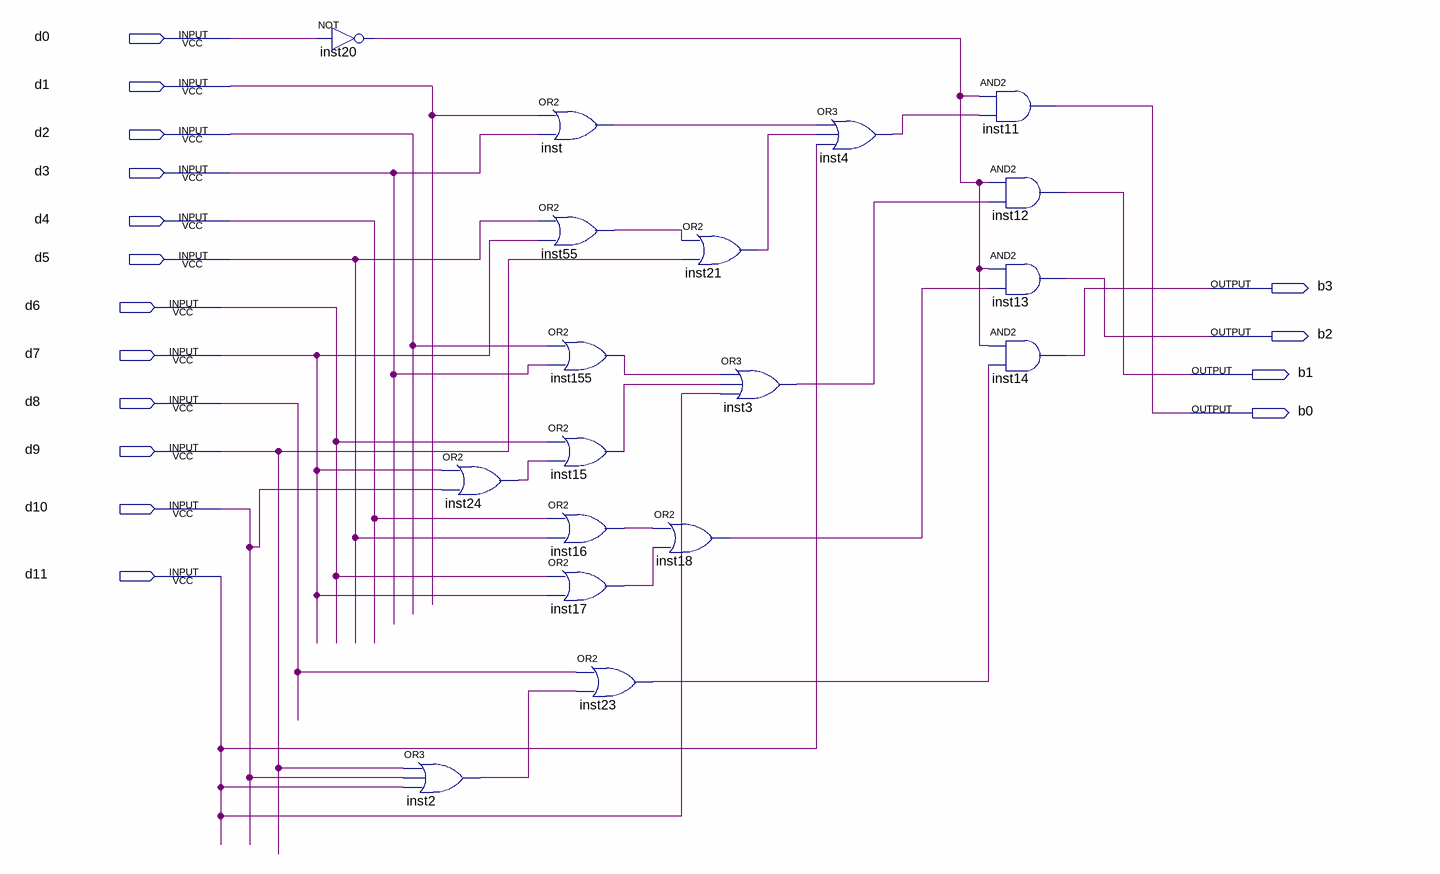
[diagram p0: schematic sheet]
// Quartus schematic d2b.bdf as structural Verilog: 18 symbols, 16 pins
module d2b (
  input  d0,
  input  d1,
  input  d2,
  input  d3,
  input  d4,
  input  d5,
  input  d6,
  input  d7,
  input  d8,
  input  d9,
  input  d10,
  input  d11,
  output b3,
  output b2,
  output b1,
  output b0
);

  wire inst2_out, inst3_out, inst4_out, inst15_out, inst16_out, inst17_out, inst18_out, inst20_out,
       inst21_out, inst23_out, inst24_out, inst55_out, inst155_out, inst_out;

  not inst20 (inst20_out, d0);
  or inst24 (inst24_out, d7, d10);
  or inst2 (inst2_out, d9, d10, d11);
  or inst (inst_out, d1, d3);
  or inst55 (inst55_out, d5, d7);
  or inst155 (inst155_out, d2, d3);
  or inst15 (inst15_out, d6, inst24_out);
  or inst16 (inst16_out, d4, d5);
  or inst17 (inst17_out, d6, d7);
  or inst23 (inst23_out, d8, inst2_out);
  or inst21 (inst21_out, inst55_out, d9);
  or inst18 (inst18_out, inst16_out, inst17_out);
  or inst3 (inst3_out, inst155_out, inst15_out, d11);
  or inst4 (inst4_out, inst_out, inst21_out, d11);
  and inst11 (b0, inst20_out, inst4_out);
  and inst12 (b1, inst20_out, inst3_out);
  and inst13 (b2, inst20_out, inst18_out);
  and inst14 (b3, inst20_out, inst23_out);
endmodule
